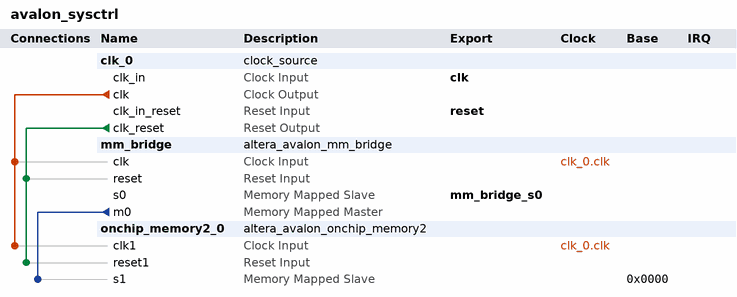
[diagram p0: system contents]
# Platform Designer (Qsys) system avalon_sysctrl, Arria V 5ASTMD3E3F31I3
# Parameters at their usual value, and those the tool derives, are not listed.
package require -exact qsys 14.0
create_system avalon_sysctrl
set_project_property DEVICE_FAMILY {Arria V}
set_project_property DEVICE 5ASTMD3E3F31I3

add_instance clk_0 clock_source 14.0
set_instance_parameter_value clk_0 clockFrequency 50000000
set_instance_parameter_value clk_0 clockFrequencyKnown false

add_instance mm_bridge altera_avalon_mm_bridge 14.0
set_instance_parameter_value mm_bridge DATA_WIDTH 32
set_instance_parameter_value mm_bridge ADDRESS_WIDTH 24
set_instance_parameter_value mm_bridge USE_AUTO_ADDRESS_WIDTH 0
set_instance_parameter_value mm_bridge ADDRESS_UNITS SYMBOLS
set_instance_parameter_value mm_bridge MAX_PENDING_RESPONSES 1
set_instance_parameter_value mm_bridge PIPELINE_COMMAND 0
set_instance_parameter_value mm_bridge PIPELINE_RESPONSE 0

add_instance onchip_memory2_0 altera_avalon_onchip_memory2 14.0
set_instance_parameter_value onchip_memory2_0 dataWidth 32
set_instance_parameter_value onchip_memory2_0 dualPort false
set_instance_parameter_value onchip_memory2_0 initMemContent false
set_instance_parameter_value onchip_memory2_0 initializationFileName onchip_mem.hex
set_instance_parameter_value onchip_memory2_0 memorySize 1024
set_instance_parameter_value onchip_memory2_0 readDuringWriteMode OLD_DATA

# connections
add_connection clk_0.clk mm_bridge.clk clock
add_connection clk_0.clk onchip_memory2_0.clk1 clock
add_connection clk_0.clk_reset mm_bridge.reset reset
add_connection clk_0.clk_reset onchip_memory2_0.reset1 reset
add_connection mm_bridge.m0 onchip_memory2_0.s1 avalon
set_connection_parameter_value mm_bridge.m0/onchip_memory2_0.s1 baseAddress 0x0000

# exported interfaces
add_interface clk clock sink
set_interface_property clk EXPORT_OF clk_0.clk_in
add_interface reset reset sink
set_interface_property reset EXPORT_OF clk_0.clk_in_reset
add_interface mm_bridge_s0 avalon slave
set_interface_property mm_bridge_s0 EXPORT_OF mm_bridge.s0

set_interconnect_requirement {$system} qsys_mm.clockCrossingAdapter HANDSHAKE
set_interconnect_requirement {$system} qsys_mm.maxAdditionalLatency 1
set_interconnect_requirement {$system} qsys_mm.insertDefaultSlave FALSE

save_system avalon_sysctrl.qsys
